# Altium schematic sheet ASBB_5VBuck.SchDoc
size A4
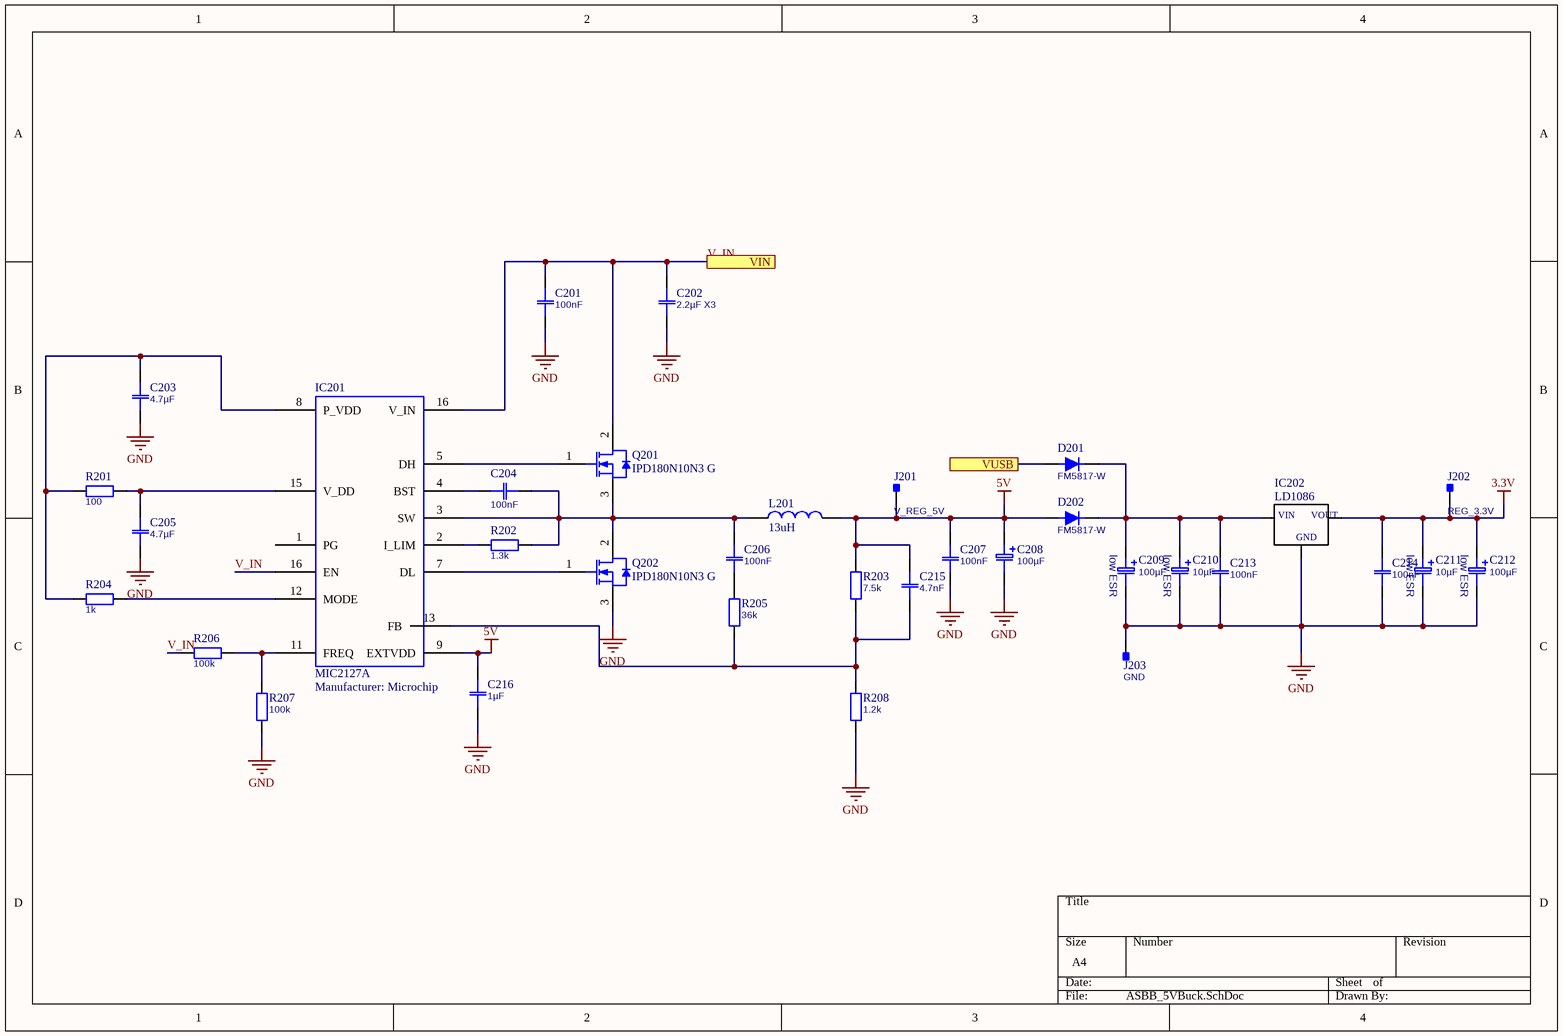
[diagram p0: ASBB_5VBuck.SchDoc]

## Parts
C201  100nF  [CAP 1206/3216]
C202  2.2µF X3  [CAP 1206/3216]
C203  4.7µF  [CAP 1206/3216]
C204  100nF  [CAP 1206/3216]
C205  4.7µF  [CAP 1206/3216]
C206  100nF  [0603]
C207  100nF  [0603]
C208  100µF  [CAP ALUM 6.6MM]
C209  100µF  [CAP ALUM 6.6MM]
C210  10µF  [CAP ALUM 6.6MM]
C211  10µF  [CAP ALUM 6.6MM]
C212  100µF  [CAP ALUM 6.6MM]
C213  100nF  [0603]
C214  100nF  [0603]
C215  4.7nF  [0603]
C216  1µF  [0603]
D201  FM5817-W  [SMB]
D202  FM5817-W  [SMB]
IC201  MIC2127A  Manufacturer: Microchip  [MCHP-QFN-MG16_N]
IC202  LD1086  [D2PAK_LD1086(Primary)]
J201  V_REG_5V  [PIN1]
J202  REG_3.3V  [PIN1]
J203  GND  [PIN1]
L201  value 13uH  [WE-HCI_1365_WE-PERM]  (hidden comment: 7443551131)
Q201  IPD180N10N3 G  [INF-PG-TO252-3-11_A_N]
Q202  IPD180N10N3 G  [INF-PG-TO252-3-11_A_N]
R201  100  [0603]
R202  1.3k  [0603]
R203  7.5k  [0603]
R204  1k  [0603]
R205  36k  [0603]
R206  100k  [CAP 1206/3216]
R207  100k  [CAP 1206/3216]
R208  1.2k  [0603]

## Ports
VIN, VUSB

## Nets
3.3V: C211.1(+) C212.1(+) C214.2 IC202.VOUT J202.1
5V: C207.1 C208.1(+) C215.1 C216.1 D202.2(A) IC201.9(EXTVDD) J201.1 L201.2 R203.2
GND: C201.1 C202.1 C203.2 C205.2 C207.2 C208.2(-) C209.2(-) C210.2(-) C211.2(-) C212.2(-) C213.1 C214.1 C216.2 IC202.GND J203.1 Q202.3(SOURCE) R207.1 R208.1
V_IN: C201.2 C202.2 IC201.16(EN) Q201.2(DRAIN) R206.1 ; port VIN
VUSB: D201.2(A) ; port VUSB
NetC203_1: C203.1 IC201.8(P_VDD) R201.1 R204.1
NetC204_1: C204.1 C206.1 IC201.3(SW) L201.1 Q201.3(SOURCE) Q202.2(DRAIN) R202.2
NetC204_2: C204.2 IC201.4(BST)
NetC205_1: C205.1 IC201.15(V_DD) R201.2
NetC206_2: C206.2 R205.2
NetC209_1: C209.1(+) C210.1(+) C213.2 D201.1(C) D202.1(C) IC202.VIN
NetC215_2: C215.2 IC201.13(FB) R203.1 R205.1 R208.2
NetIC201_2: IC201.2(I_LIM) R202.1
NetIC201_5: IC201.5(DH) Q201.1(GATE)
NetIC201_7: IC201.7(DL) Q202.1(GATE)
NetIC201_11: IC201.11(FREQ) R206.2 R207.2
NetIC201_12: IC201.12(MODE) R204.2

Not connected (* = marked no-connect by the designer): IC201 1(PG)

## Notes on the sheet
- (in symbol Capacitor polarised low ESR) low ESR

## Library data of the parts
C201-C207 C213-C216 = Capacitor: Partnumber: ?; Value: ?
C208 = Capacitor polarised: Capacitor, polarised; Partnumber: ?; Value: ?
C209-C212 = Capacitor polarised low ESR: Capacitor, polarised, low ESR; Partnumber: ?; Value: ?
D201 D202 = Diode: Partnumber: ?; Value: ?
IC201 = MIC2127A: 75V, Synchronous Buck Controller Featuring ADaptive On-Time Control
IC202 = LD1086: Semiconductors and Actives; MF: STMicroelectronics; MP: LD1086; Availability: Unavailable; SnapEDA_Link: https://www.snapeda.com/parts/LD1086/STMicroelectronics/view-part/?ref=snap; Package: None; Price: None; Value: *
J201-J203 = Pad 1 Pin: Pad, 1 Pin
L201 = 7443551131: WE-HCI SMD Flat Wire High Current Inductor, size 1365, 10A, 13uH; Material: WE-PERM; ComponentLink1Description: Manufacturer; ComponentLink1URL: http://www.we-online.de; ComponentLink2Description: Datasheet; ComponentLink2URL: http://katalog.we-online.de/pbs/datasheet/7443551131.pdf; Part Number: 7443551131; Published Date: July 2017; Publisher: Wurth Elektronik; Rated Current: 10A; Size: 1365
Q201 Q202 = IPD180N10N3 G: N-Channel OptiMOS 3 Power-Transistor, 100 V VDS, 43 A ID, -55 to 175 degC, PG-TO252-3-11, Reel, Green; Manufacturer: Infineon; Green: TRUE; ID (max): 43 A; IDpuls (max): 172 A; Polarity: N; Ptot (max): 71 W; QG: 19 nC; RDS (on) (max): 18 mOhm; Rth: 2.1 K/W; RthJA (max): 75 K/W; VDS (max): 100 V; VGS(th) (max): 3.5 V; VGS(th) (min): 2 V; DatasheetVersion: Rev. 2.2; PackageVersion: Rev. 02, 03/2007; PackageReference: PG-TO252-3-11; PackageDescription: 3-Pin Plastic (Green) Transistor Single Outline Package, 6.57 x 6.1 mm Body, 2.29 mm Pitch; Supplier 1: Digi-Key; Supplier Part Number 1: IPD180N10N3 GTR-ND; Supplier 2: Digi-Key; Supplier Part Number 2: IPD180N10N3 GCT-ND; Supplier 3: Digi-Key; Supplier Part Number 3: IPD180N10N3 GDKR-ND; Packing: Reel; RthJC (max): 2.1 K/W; Mounting Technology: Surface Mount; PartNumber: IPD180N10N3 G; ComponentLink1Description: Manufacturer URL; ComponentLink1URL: http://www.infineon.com/; ComponentLink2Description: Datasheet; ComponentLink2URL: http://www.infineon.com/dgdl/IPD180N10N3+G_Rev2.2.pdf?folderId=db3a304313b8b5a60113cee8763b02d7&fileId=db3a30432239cccd01226070a4bb7fb9; ComponentLink3Description: Package Specification; ComponentLink3URL: http://www.infineon.com/dgdl/IPD160N04L_rev1.0.pdf?folderId=db3a3043163797a6011643468e7505a4&fileId=db3a3043163797a60116436401cf05cf
R201-R208 = Resistor: Partnumber: ?; Value: ?